# EAGLE schematic lks (EAGLE 9.5.0)
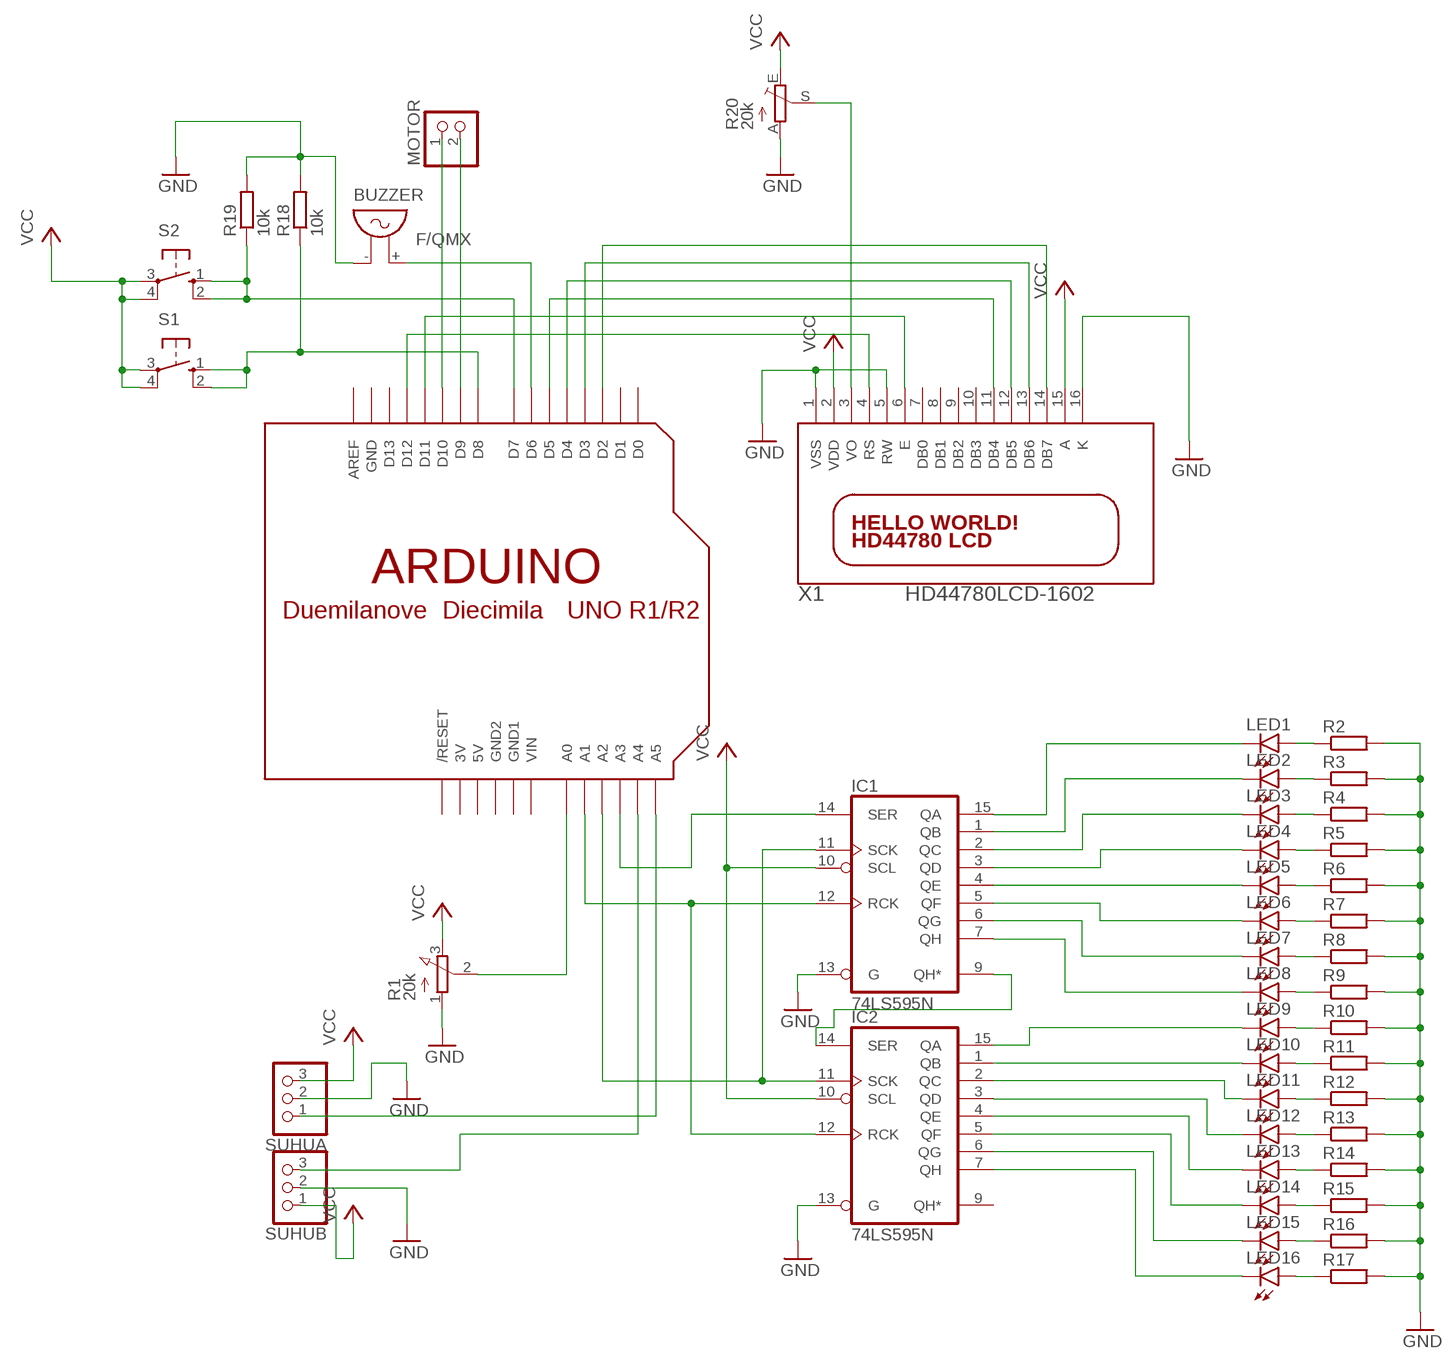
[diagram p0: schematic, sheet 1]

## Parts
BUZZER  F/QMX  [F/QMX]
IC1  74LS595N  [DIL16]
IC2  74LS595N  [DIL16]
LED1  LED3MM  [LED3MM]
LED2  LED3MM  [LED3MM]
LED3  LED3MM  [LED3MM]
LED4  LED3MM  [LED3MM]
LED5  LED3MM  [LED3MM]
LED6  LED3MM  [LED3MM]
LED7  LED3MM  [LED3MM]
LED8  LED3MM  [LED3MM]
LED9  LED3MM  [LED3MM]
LED10  LED3MM  [LED3MM]
LED11  LED3MM  [LED3MM]
LED12  LED3MM  [LED3MM]
LED13  LED3MM  [LED3MM]
LED14  LED3MM  [LED3MM]
LED15  LED3MM  [LED3MM]
LED16  LED3MM  [LED3MM]
MOTOR  PINHD-1X2  [1X02]
R1  20k  3RP/1610N  [3RP/1610N]
R2  R-EU_0207/7  [0207/7]
R3  R-EU_0207/7  [0207/7]
R4  R-EU_0207/7  [0207/7]
R5  R-EU_0207/7  [0207/7]
R6  R-EU_0207/7  [0207/7]
R7  R-EU_0207/7  [0207/7]
R8  R-EU_0207/7  [0207/7]
R9  R-EU_0207/7  [0207/7]
R10  R-EU_0207/7  [0207/7]
R11  R-EU_0207/7  [0207/7]
R12  R-EU_0207/7  [0207/7]
R13  R-EU_0207/7  [0207/7]
R14  R-EU_0207/7  [0207/7]
R15  R-EU_0207/7  [0207/7]
R16  R-EU_0207/7  [0207/7]
R17  R-EU_0207/7  [0207/7]
R18  10k  R-EU_0207/7  [0207/7]
R19  10k  R-EU_0207/7  [0207/7]
R20  20k  TRIM_EU-CA6V  [CA6V]
S1  10-XX  [B3F-10XX]
S2  10-XX  [B3F-10XX]
SUHUA  PINHD-1X3  [1X03]
SUHUB  PINHD-1X3  [1X03]
U$1  ARDUINO-NOHOLE  [ARDUINO-NOHOLE]
X1  HD44780LCD-1602  [LCD1602]

## Nets
GND: BUZZER.- IC1.13(G) IC2.13(G) R1.1(A) R2.2 R3.2 R4.2 R5.2 R6.2 R7.2 R8.2 R9.2 R10.2 R11.2 R12.2 R13.2 R14.2 R15.2 R16.2 R17.2 R18.2 R19.2 R20.A SUHUA.2 SUHUB.2 X1.1(VSS) X1.5(RW) X1.16(K)
N$1: U$1.D12 X1.4(RS)
N$2: U$1.D11 X1.6(E)
N$3: U$1.D5 X1.11(DB4)
N$4: U$1.D4 X1.12(DB5)
N$5: U$1.D3 X1.13(DB6)
N$6: U$1.D2 X1.14(DB7)
N$7: R1.2(S) U$1.A0
N$8: BUZZER.+ U$1.D6
N$9: R19.1 S2.1(S) S2.2(S1) U$1.D7
N$10: R18.1 S1.1(S) S1.2(S1) U$1.D8
N$11: IC1.15(QA) LED1.K(C)
N$12: IC1.1(QB) LED2.K(C)
N$13: IC1.2(QC) LED3.K(C)
N$14: IC1.3(QD) LED4.K(C)
N$15: IC1.4(QE) LED5.K(C)
N$16: IC1.5(QF) LED6.K(C)
N$17: IC1.6(QG) LED7.K(C)
N$18: IC1.7(QH) LED8.K(C)
N$19: IC2.15(QA) LED9.K(C)
N$20: IC2.1(QB) LED10.K(C)
N$21: IC2.2(QC) LED11.K(C)
N$22: IC2.3(QD) LED12.K(C)
N$23: SUHUA.1 U$1.A5
N$24: IC2.4(QE) LED13.K(C)
N$25: IC2.5(QF) LED14.K(C)
N$26: IC2.6(QG) LED15.K(C)
N$27: IC2.7(QH) LED16.K(C)
N$28: IC1.14(SER) U$1.A3
N$29: LED1.A R2.1
N$30: LED2.A R3.1
N$31: LED3.A R4.1
N$32: LED4.A R5.1
N$33: LED5.A R6.1
N$34: LED6.A R7.1
N$35: LED7.A R8.1
N$36: LED8.A R9.1
N$37: LED9.A R10.1
N$38: LED10.A R11.1
N$39: LED11.A R12.1
N$40: LED12.A R13.1
N$41: LED13.A R14.1
N$42: LED14.A R15.1
N$43: LED15.A R16.1
N$44: LED16.A R17.1
N$45: R20.S X1.3(VO)
N$46: SUHUB.3 U$1.A4
N$47: MOTOR.1 U$1.D10
N$48: IC1.11(SCK) IC2.11(SCK) U$1.A2
N$49: IC1.12(RCK) IC2.12(RCK) U$1.A1
N$50: IC1.9(QH*) IC2.14(SER)
N$51: MOTOR.2 U$1.D9
VCC: IC1.10(SCL) IC2.10(SCL) R1.3(E) R20.E S1.3(P) S1.4(P1) S2.3(P) S2.4(P1) SUHUA.3 SUHUB.1 X1.2(VDD) X1.15(A)
Unconnected: IC2.9(QH*) U$1.AREF U$1.D0 U$1.D1 U$1.D13 U$1.RESET(/RESET) X1.7(DB0) X1.8(DB1) X1.9(DB2) X1.10(DB3)

## Power pins joined to a net without a drawn wire
3V: U$1.3V
5V: U$1.5V
GND: IC1.8(GND) IC2.8(GND) U$1.GND
GND1: U$1.GND1
GND2: U$1.GND2
VCC: IC1.16(VCC) IC2.16(VCC)
VIN: U$1.VIN

## Library data of the parts
BUZZER = buzzer:F/QMX: BUZZER Source: Buerklin; OC_FARNELL: unknown; OC_NEWARK: unknown
IC1 IC2 = 74xx-eu:74*595: 8-bit SHIFT REGISTER, output latch
LED1-LED16 = led:LED: LED OSRAM: - CHIPLED LG R971, LG N971, LY N971, LG Q971, LY Q971, LO R971, LY R971 LH N974, LH R974 LS Q976, LO Q976, LY Q976 LO Q996 - Hyper CHIPLED LW Q18S LB Q993, LB Q99A, LB R99A - SideLED LS A670, LO A670, LY A670, LG A670, LP A670 LB A673, LV A673, LT A673, LW A673 LH A674 LY A675 LS A676, LA A676, LO A676, LY A676, LW A676 LS A679, LY A679, LG A679 - Hyper Micro SIDELED® LS Y876, LA Y876, LO Y876, LY Y876 LT Y87S - SmartLED LW L88C, LW L88S LB L89C, LB L89S, LG L890 LS L89K, LO L89K, LY L89K LS L896, LA L896, LO L896, LY L896 - TOPLED LS T670, LO T670, LY T670, LG T670, LP T670 LSG T670, LSP T670, LSY T670, LOP T670, LYG T670 LG T671, LOG T671, LSG T671 LB T673, LV T673, LT T673, LW T673 LH T674 LS T676, LA T676, LO T676, LY T676, LB T676, LH T676, LSB T676, LW T676 LB T67C, LV T67C, LT T67C, LS T67K, LO T67K, LY T67K, LW E67C LS E67B, LA E67B, LO E67B, LY E67B, LB E67C, LV E67C, LT E67C LW T67C LS T679, LY T679, LG T679 LS T770, LO T770, LY T770, LG T770, LP T770 LB T773, LV T773, LT T773, LW T773 LH T774 LS E675, LA E675, LY E675, LS T675 LS T776, LA T776, LO T776, LY T776, LB T776 LHGB T686 LT T68C, LB T68C - Hyper Mini TOPLED® LB M676 - Mini TOPLED Santana® LG M470 LS M47K, LO M47K, LY M47K Source: http://www.osram.convergy.de LUXEON: - LUMILED® LXK2-PW12-R00, LXK2-PW12-S00, LXK2-PW14-U00, LXK2-PW14-V00 LXK2-PM12-R00, LXK2-PM12-S00, LXK2-PM14-U00 LXK2-PE12-Q00, LXK2-PE12-R00, LXK2-PE12-S00, LXK2-PE14-T00, LXK2-PE14-U00 LXK2-PB12-K00, LXK2-PB12-L00, LXK2-PB12-M00, LXK2-PB14-N00, LXK2-PB14-P00, LXK2-PB14-Q00 LXK2-PR12-L00, LXK2-PR12-M00, LXK2-PR14-Q00, LXK2-PR14-R00 LXK2-PD12-Q00, LXK2-PD12-R00, LXK2-PD12-S00 LXK2-PH12-R00, LXK2-PH12-S00 LXK2-PL12-P00, LXK2-PL12-Q00, LXK2-PL12-R00 Source: www.luxeon.com KINGBRIGHT: KA-3528ASYC Source: www.kingbright.com
MOTOR = pinhead:PINHD-1X2: PIN HEADER
R1 = pot:3RP/1610N: 16mm Potentiometer one level Source: http://www.alphapotentiometers.net/html/16mm_pot_2.html
R2-R19 = rcl:R-EU_: RESISTOR, European symbol; SPICEPREFIX: R
R20 = pot:TRIM_EU-: POTENTIOMETER
S1 S2 = switch-omron:10-XX: OMRON SWITCH; MPN: B3F-1000; OC_FARNELL: 176432; OC_NEWARK: 36M3542
SUHUA SUHUB = pinhead:PINHD-1X3: PIN HEADER
U$1 = adafruit:ARDUINO: Arduino Diecimila/Duemilanove Make a shield with ease, this package has all the named pins as well as the two mounting drill holes and an outline of the USB and DC power connector. The outline is on the DIMENSION layer, so if your board house uses it they will cut the outline to match. http://www.ladyada.net/library/pcb/eaglelibrary.html
X1 = adafruit:HD44780LCD: HD44780 LCD Standard character type LCDs, available in sizes from 8x1 to 40x4!